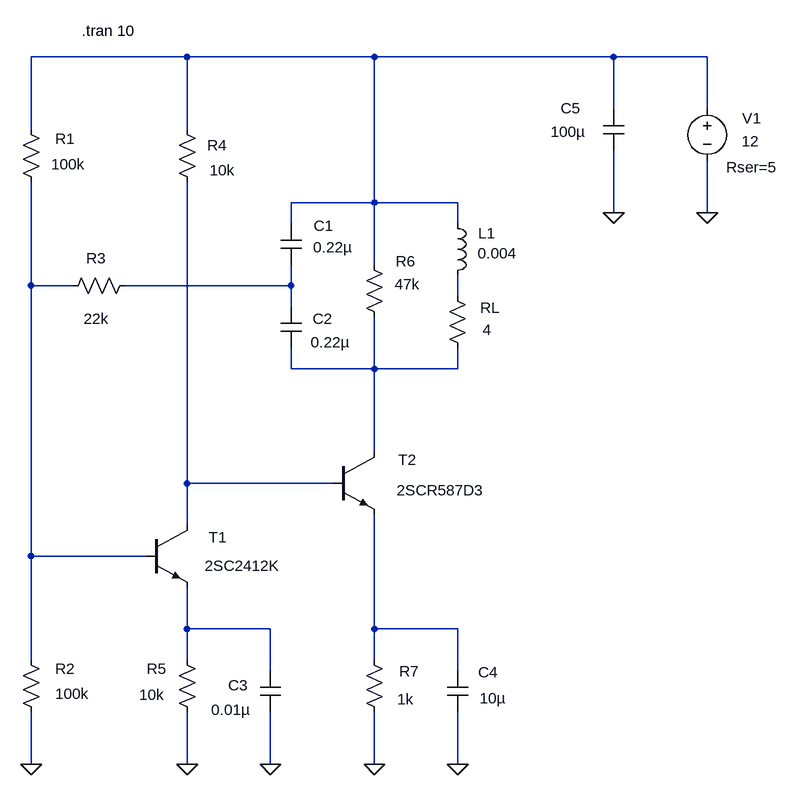
[diagram p0: schematic LC_OscillatorCapsFeedback1.asc]
LC_OscillatorCapsFeedback1.asc, the LTspice schematic file:
Version 4
SHEET 1 880 820
WIRE -432 -288 -672 -288
WIRE -144 -288 -432 -288
WIRE 224 -288 -144 -288
WIRE 368 -288 224 -288
WIRE 224 -208 224 -288
WIRE 368 -208 368 -288
WIRE -672 -176 -672 -288
WIRE -432 -176 -432 -288
WIRE -144 -64 -144 -288
WIRE -144 -64 -272 -64
WIRE -16 -64 -144 -64
WIRE 224 -48 224 -144
WIRE 368 -48 368 -128
WIRE -272 -32 -272 -64
WIRE -16 -32 -16 -64
WIRE -144 32 -144 -64
WIRE -672 64 -672 -96
WIRE -608 64 -672 64
WIRE -272 64 -272 32
WIRE -272 64 -528 64
WIRE -16 80 -16 48
WIRE -272 96 -272 64
WIRE -272 192 -272 160
WIRE -144 192 -144 112
WIRE -144 192 -272 192
WIRE -16 192 -16 160
WIRE -16 192 -144 192
WIRE -144 320 -144 192
WIRE -432 368 -432 -96
WIRE -208 368 -432 368
WIRE -432 432 -432 368
WIRE -672 480 -672 64
WIRE -496 480 -672 480
WIRE -432 592 -432 528
WIRE -304 592 -432 592
WIRE -144 592 -144 416
WIRE -16 592 -144 592
WIRE -672 640 -672 480
WIRE -432 640 -432 592
WIRE -144 640 -144 592
WIRE -304 656 -304 592
WIRE -16 656 -16 592
WIRE -672 800 -672 720
WIRE -432 800 -432 720
WIRE -304 800 -304 720
WIRE -144 800 -144 720
WIRE -16 800 -16 720
FLAG -144 800 0
FLAG -16 800 0
FLAG 368 -48 0
FLAG -432 800 0
FLAG -672 800 0
FLAG 224 -48 0
FLAG -304 800 0
SYMBOL ind -32 -48 R0
WINDOW 0 48 31 Left 2
WINDOW 3 47 62 Left 2
SYMATTR InstName L1
SYMATTR Value 0.004
SYMBOL res -32 64 R0
WINDOW 0 51 34 Left 2
WINDOW 3 55 68 Left 2
SYMATTR InstName RL
SYMATTR Value 4
SYMBOL cap -288 -32 R0
WINDOW 0 51 4 Left 2
WINDOW 3 50 37 Left 2
SYMATTR InstName C1
SYMATTR Value 0.22µ
SYMBOL cap -288 96 R0
WINDOW 0 49 19 Left 2
WINDOW 3 46 55 Left 2
SYMATTR InstName C2
SYMATTR Value 0.22µ
SYMBOL npn -208 320 R0
WINDOW 0 101 12 Left 2
WINDOW 3 98 59 Left 2
SYMATTR InstName T2
SYMATTR Value 2SCR587D3
SYMBOL res -160 624 R0
WINDOW 0 54 33 Left 2
WINDOW 3 51 76 Left 2
SYMATTR InstName R7
SYMATTR Value 1k
SYMBOL cap -32 656 R0
WINDOW 0 48 3 Left 2
WINDOW 3 50 43 Left 2
SYMATTR InstName C4
SYMATTR Value 10µ
SYMBOL res -448 -192 R0
WINDOW 0 47 40 Left 2
WINDOW 3 51 78 Left 2
SYMATTR InstName R4
SYMATTR Value 10k
SYMBOL voltage 368 -224 R0
WINDOW 0 54 30 Left 2
WINDOW 3 53 66 Left 2
WINDOW 123 0 0 Left 0
WINDOW 39 29 106 Left 2
SYMATTR InstName V1
SYMATTR Value 12
SYMATTR SpiceLine Rser=5
SYMBOL npn -496 432 R0
WINDOW 0 97 19 Left 2
WINDOW 3 91 63 Left 2
SYMATTR InstName T1
SYMATTR Value 2SC2412K
SYMBOL res -448 624 R0
WINDOW 0 -46 29 Left 2
WINDOW 3 -58 69 Left 2
SYMATTR InstName R5
SYMATTR Value 10k
SYMBOL res -688 -192 R0
WINDOW 0 53 30 Left 2
WINDOW 3 47 69 Left 2
SYMATTR InstName R1
SYMATTR Value 100k
SYMBOL res -688 624 R0
WINDOW 0 53 29 Left 2
WINDOW 3 53 68 Left 2
SYMATTR InstName R2
SYMATTR Value 100k
SYMBOL cap 208 -208 R0
WINDOW 0 -65 -1 Left 2
WINDOW 3 -81 35 Left 2
SYMATTR InstName C5
SYMATTR Value 100µ
SYMBOL res -512 48 R90
WINDOW 0 -11 60 VBottom 2
WINDOW 3 51 60 VTop 2
SYMATTR InstName R3
SYMATTR Value 22k
SYMBOL res -160 16 R0
WINDOW 0 49 10 Left 2
WINDOW 3 47 46 Left 2
SYMATTR InstName R6
SYMATTR Value 47k
SYMBOL cap -320 656 R0
WINDOW 0 -49 23 Left 2
WINDOW 3 -75 60 Left 2
SYMATTR InstName C3
SYMATTR Value 0.01µ
TEXT -594 -328 Left 2 !.tran 10

The netlist it stands for:
* LC_OscillatorCapsFeedback1.asc
L1 N001 N004 0.004
RL N004 N005 4
C1 N001 N003 0.22µ
C2 N003 N005 0.22µ
Q§T2 N005 N006 N008 0 2SCR587D3
R7 N008 0 1k
C4 N008 0 10µ
R4 N001 N006 10k
V1 N001 0 12 Rser=5
Q§T1 N006 N002 N007 0 2SC2412K
R5 N007 0 10k
R1 N001 N002 100k
R2 N002 0 100k
C5 N001 0 100µ
R3 N003 N002 22k
R6 N001 N005 47k
C3 N007 0 0.01µ
.model NPN NPN
.model PNP PNP
.lib standard.bjt
.tran 10
.backanno
.end